# Altium project uc3843 flyback converter.PrjPcb
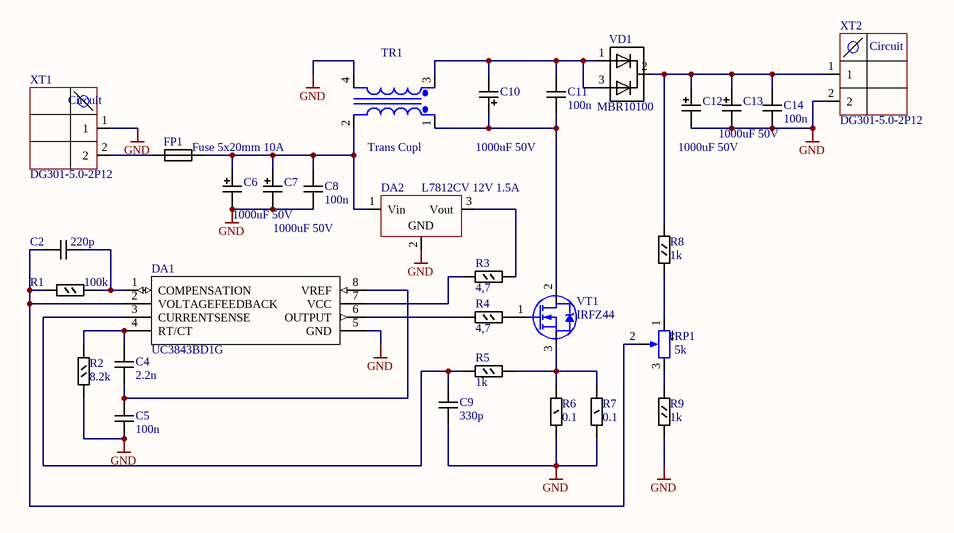
[diagram p0: uc3843 flyback converter.SchDoc]
1 sheet, 30 parts. Net scope: global (net labels, ports and power ports of the same name join across sheets).
Board file: uc3843 flyback converter.PcbDoc

## Sheet uc3843 flyback converter.SchDoc
size A

### Parts
C2  220p  [CAPC2012(0805)N]
C4  2.2n  [CAPC2012(0805)N]
C5  100n  [CAPC2012(0805)N]
C6  1000uF 50V  [CAPPRD500W60D1300H2650]
C7  1000uF 50V  [CAPPRD500W60D1300H2650]
C8  100n  [CAPC2012(0805)N]
C9  330p  [CAPC2012(0805)N]
C10  1000uF 50V  [CAPPRD500W60D1300H2650]
C11  100n  [CAPC2012(0805)N]
C12  1000uF 50V  [CAPPRD500W60D1300H2650]
C13  1000uF 50V  [CAPPRD500W60D1300H2650]
C14  100n  [CAPC2012(0805)N]
DA1  UC3843BD1G  [SO-8_N]
DA2  L7812CV 12V 1.5A  [TO-220AB]
FP1  Fuse 5x20mm 10A  [FUSE_5X20MM]
R1  100k  [RESC2012(0805)N]
R2  8.2k  [RESC2012(0805)N]
R3  4,7  [RESC2012(0805)N]
R4  4,7  [RESC2012(0805)N]
R5  1k  [RESC2012(0805)N]
R6  0.1  [1206]
R7  0.1  [1206]
R8  1k  [RESC2012(0805)N]
R9  1k  [RESC2012(0805)N]
RP1  5k  [3296W]
TR1  Trans Cupl  [Coilcraft-CMT1_3]
VD1  MBR10100  [TO-247AD]
VT1  IRFZ44  [TO-220AB]
XT1  DG301-5.0-2P12  [DG301-5.0-2P12]
XT2  DG301-5.0-2P12  [DG301-5.0-2P12]

### Nets
GND: C5.1 C6.2 C7.2 C8.1 C9.2 C12.2 C13.2 C14.1 DA1.5(GND) DA2.2(GND) R2.1 R6.1 R7.1 R9.2 TR1.4(Sec-) XT1.1 XT2.2
NetC2_1: C2.1 DA1.2(VOLTAGEFEEDBACK) R1.2 RP1.2(BOT)
NetC2_2: C2.2 DA1.1(COMPENSATION) R1.1
NetC4_1: C4.1 C5.2 DA1.8(VREF)
NetC4_2: C4.2 DA1.4(RT/CT) R2.2
NetC6_1: C6.1 C7.1 C8.2 DA2.1(Vin) FP1.2 TR1.2(Pri-)
NetC9_1: C9.1 DA1.3(CURRENTSENSE) R5.2
NetC10_1: C10.1 C11.2 TR1.1(Pri+) VT1.2(D)
NetC10_2: C10.2 C11.1 TR1.3(Sec+) VD1.1 VD1.3
NetC12_1: C12.1 C13.1 C14.2 R8.1 VD1.2 XT2.1
NetDA1_6: DA1.6(OUTPUT) R4.2
NetDA1_7: DA1.7(VCC) R3.2
NetDA2_3: DA2.3(Vout) R3.1
NetFP1_1: FP1.1 XT1.2
NetR4_1: R4.1 VT1.1(G)
NetR5_1: R5.1 R6.2 R7.2 VT1.3(S)
NetR8_2: R8.2 RP1.1(TOP)
NetR9_1: R9.1 RP1.3(TAP)

### Notes on the sheet
- (in symbol DG301-5.0-2P12) Circuit

### Library data of the parts
C2 C4 C5 C8 C9 C11 C14 = CAPC2012(0805): Part Number: CAPC2012(0805); Package: 0805
C6 C7 C10 C12 C13 = UVY1H102MHD: CAP ALUM 1000UF 20% 50V RADIAL; Part Number: UVY1H102MHD; HelpURL: https://www.digikey.com/product-detail/en/nichicon/UVY1H102MHD/UVY1H102MHD-ND/2428007; Digi-Key Part Number: UVY1H102MHD-ND; Price$: 0.31818; Manufacturer Part Number: UVY1H102MHD; Package: TH 2 pin
DA1 = UC3843BD1G: Switching Controllers 52kHz 1A Current PWM w/96% Duty Cycle Max; Manufacturer_Name: ON Semiconductor; Datasheet Link: http://www.onsemi.com/pub/Collateral/UC3842B-D.PDF; Height: 1.75mm; Manufacturer_Part_Number: UC3843BD1G; Arrow Part Number: UC3843BD1G; Arrow Price/Stock: https://www.arrow.com/en/products/uc3843bd1g/on-semiconductor; Mouser Part Number: 863-UC3843BD1G; Mouser Price/Stock: https://www.mouser.co.uk/ProductDetail/ON-Semiconductor/UC3843BD1G?qs=xZq1yRCsb1e%2FKCJUacBVZA%3D%3D; Part Number: UC3843BD1G; HelpURL: https://eu.mouser.com/ProductDetail/ON-Semiconductor/UC3843BD1G?qs=xZq1yRCsb1e%2FKCJUacBVZA%3D%3D; Price$: 0.207; Manufacturer Part Number: UC3843BD1G
DA2 = L7812CV: Linear Voltage Regulator IC  1 Output  1.5A TO-220AB; Part Number: L7812CV; HelpURL: https://www.digikey.com/product-detail/en/stmicroelectronics/L7812CV/497-1452-5-ND/585973; Digi-Key Part Number: 497-1452-5-ND; Manufacturer Part Number: L7812CV
FP1 = Fuse 5x20mm: Part Number: Fuse 5x20mm
R1-R5 R8 R9 = RESC2012(0805): Part Number: RESC2012(0805); Package: 0805
R6 R7 = RESC3216(1206): Part Number: RESC3216(1206); Package: 1206
RP1 = Pot. 3296W: Manufacturer Part Number: ???; Part Number: Pot. 3296W; HelpURL: https://www.bourns.com/pdfs/3296.pdf
TR1 = Coilcraft-CMT1_3: Coilcraft’s CMT toroid style common mode chokes; Published: 8-Jun-2000; LatestRevisionDate: 17-Jul-2002; LatestRevisionNote: Re-released for DXP Platform.; PackageReference: TRF_4; Publisher: Altium Limited; PackageDescription: Transformer; 4 Leads; Part Number: Coilcraft-CMT1_3; HelpURL: http://www.3dcontentcentral.com/download-model.aspx?catalogid=171&id=656307
VD1 = MBR40H60PT-E3/45: Schottky Diodes & Rectifiers 60 Volt 40A Dual Common-Cathode; Part Number: MBR40H60PT-E3/45; HelpURL: http://ru.mouser.com/ProductDetail/Vishay-Semiconductors/MBR40H60PT-E3-45/?qs=NyKJzQ80QAwtL1bZZnr79w%3D%3D
VT1 = IRF630: Part Number: IRF630; HelpURL: http://www.vishay.com/docs/91031/sihf630p.pdf
XT1 XT2 = DG301-5.0-2P12: Part Number: DG301-5.0-2P12